# EAGLE design LQFP-64_to_breadboard (EAGLE 8.5.1)
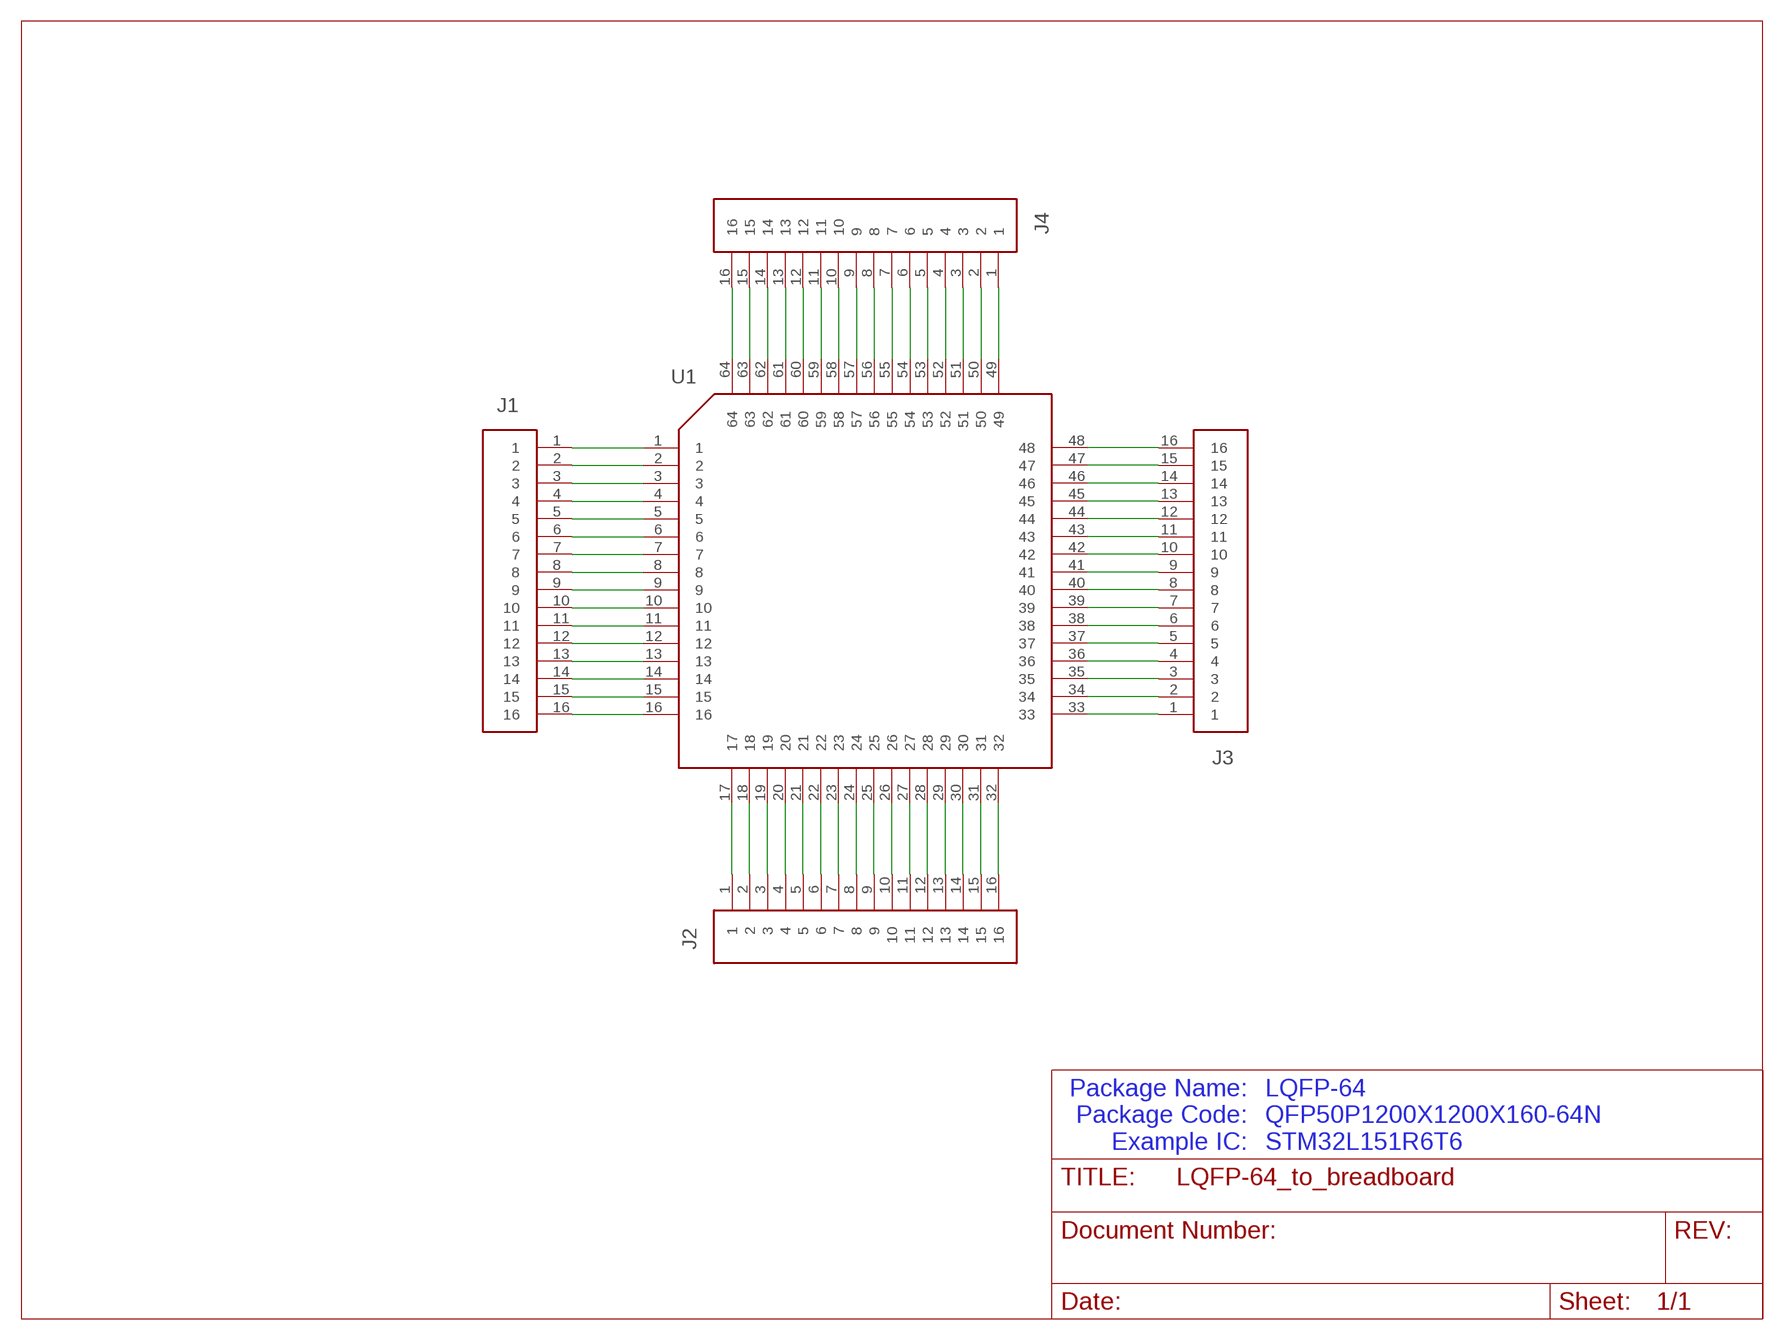
[diagram p0: schematic, sheet 1]

## Parts
J1  CONNECTOR_16  [68000-116HLF]
J2  CONNECTOR_16-NO_SQUARE  [68000-116HLF-NO-SQUARE]
J3  CONNECTOR_16-NO_SQUARE  [68000-116HLF-NO-SQUARE]
J4  CONNECTOR_16-NO_SQUARE  [68000-116HLF-NO-SQUARE]
U1  IC_GENERIC_64-LQFP  [QFP50P1200X1200X160-64N]

## Nets
N$1: J1.1 U1.1
N$2: J1.2 U1.2
N$3: J1.3 U1.3
N$4: J1.4 U1.4
N$5: J1.5 U1.5
N$6: J1.6 U1.6
N$7: J1.7 U1.7
N$8: J1.8 U1.8
N$9: J1.9 U1.9
N$10: J1.10 U1.10
N$11: J1.11 U1.11
N$12: J1.12 U1.12
N$13: J1.13 U1.13
N$14: J1.14 U1.14
N$15: J1.15 U1.15
N$16: J1.16 U1.16
N$17: J2.1 U1.17
N$18: J2.2 U1.18
N$19: J2.3 U1.19
N$20: J2.4 U1.20
N$21: J2.5 U1.21
N$22: J2.6 U1.22
N$23: J2.7 U1.23
N$24: J2.8 U1.24
N$25: J2.9 U1.25
N$26: J2.10 U1.26
N$27: J2.11 U1.27
N$28: J2.12 U1.28
N$29: J2.13 U1.29
N$30: J2.14 U1.30
N$31: J2.15 U1.31
N$32: J2.16 U1.32
N$33: J3.1 U1.33
N$34: J3.2 U1.34
N$35: J3.3 U1.35
N$36: J3.4 U1.36
N$37: J3.5 U1.37
N$38: J3.6 U1.38
N$39: J3.7 U1.39
N$40: J3.8 U1.40
N$41: J3.9 U1.41
N$42: J3.10 U1.42
N$43: J3.11 U1.43
N$44: J3.12 U1.44
N$45: J3.13 U1.45
N$46: J3.14 U1.46
N$47: J3.15 U1.47
N$48: J3.16 U1.48
N$49: J4.1 U1.49
N$50: J4.2 U1.50
N$51: J4.3 U1.51
N$52: J4.4 U1.52
N$53: J4.5 U1.53
N$54: J4.6 U1.54
N$55: J4.7 U1.55
N$56: J4.8 U1.56
N$57: J4.9 U1.57
N$58: J4.10 U1.58
N$59: J4.11 U1.59
N$60: J4.12 U1.60
N$61: J4.13 U1.61
N$62: J4.14 U1.62
N$63: J4.15 U1.63
N$64: J4.16 U1.64

## Notes on the sheet
- Package Name:
  Package Code:
  Example IC:
- LQFP-64
  QFP50P1200X1200X160-64N
  STM32L151R6T6

## Library data of the parts
J1-J4 = SnapEDA:CONNECTOR_16
U1 = SnapEDA:IC_GENERIC_64

## Board
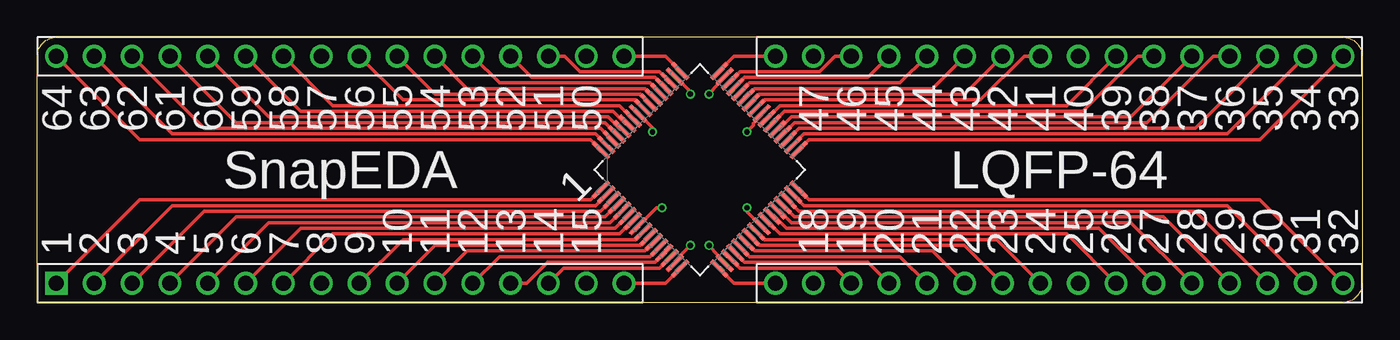
[diagram p1: board, top side]
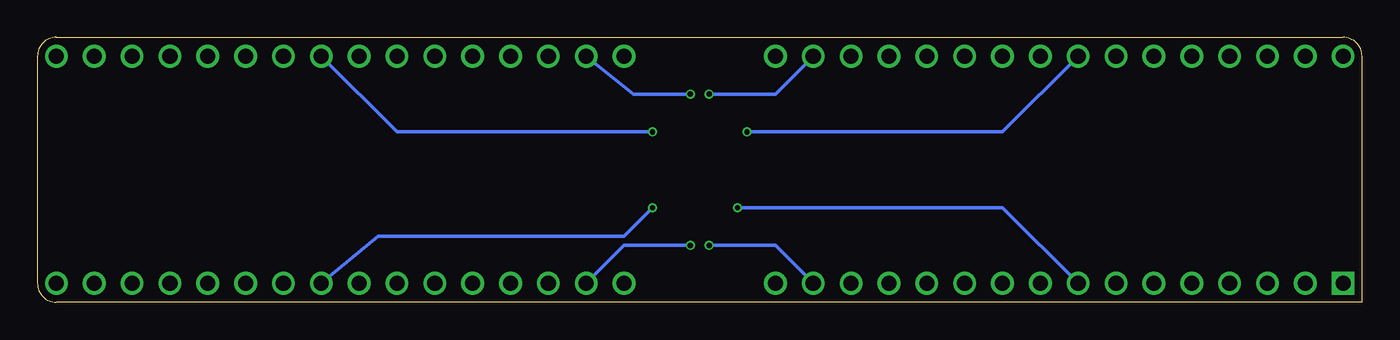
[diagram p2: board, bottom side, seen from below]

Size 88.93 x 17.78 mm. Coordinates in mm from the lower left corner, seen from the top.
Outline: 1.31,17.78 87.65,17.78 arc-90 88.92,16.51 arc0 88.92,1.27 arc-90 87.65,0
Outline: 87.63,0 0.02,0 arc0 0.02,16.51 arc-90 1.29,17.78
Copper layers (1*16): Top 0.035559375mm / dielectric 1.6mm / Bottom 0.035559375mm
Design rules "oshpark-2layer": minimum track width 6mil, minimum drill 10mil, track to track 6mil, track to pad 6mil, pad to pad 6mil, via to via 6mil, smd to smd 6mil, copper to edge 15mil, drill to drill 6mil, minimum pad ring 5mil, minimum via ring 5mil, stop-mask expansion 2.5mil, vias tented up to drill 0mil, thermal gap 10mil

### Footprints (pad centres in the part's own frame; a part is rotated, then mirrored left to right if it is on the bottom)
68000-116HLF = drill 1.016 square: 1 0,0 | drill 1.016: 2 2.54,0; 3 5.08,0; 4 7.62,0; 5 10.16,0; 6 12.7,0; 7 15.24,0; 8 17.78,0; 9 20.32,0; 10 22.86,0; 11 25.4,0; 12 27.94,0; 13 30.48,0; 14 33.02,0; 15 35.56,0; 16 38.1,0
68000-116HLF-NO-SQUARE = drill 1.016: 1 0,0; 2 2.54,0; 3 5.08,0; 4 7.62,0; 5 10.16,0; 6 12.7,0; 7 15.24,0; 8 17.78,0; 9 20.32,0; 10 22.86,0; 11 25.4,0; 12 27.94,0; 13 30.48,0; 14 33.02,0; 15 35.56,0; 16 38.1,0
QFP50P1200X1200X160-64N = smd 1.473 x 0.279: 1 -5.613,3.759; 2 -5.613,3.251; 3 -5.613,2.743; 4 -5.613,2.261; 5 -5.613,1.753; 6 -5.613,1.245; 7 -5.613,0.762; 8 -5.613,0.254; 9 -5.613,-0.254; 10 -5.613,-0.762; 11 -5.613,-1.245; 12 -5.613,-1.753; 13 -5.613,-2.261; 14 -5.613,-2.743; 15 -5.613,-3.251; 16 -5.613,-3.759; 33 5.613,-3.759; 34 5.613,-3.251; 35 5.613,-2.743; 36 5.613,-2.261; 37 5.613,-1.753; 38 5.613,-1.245; 39 5.613,-0.762; 40 5.613,-0.254; 41 5.613,0.254; 42 5.613,0.762; 43 5.613,1.245; 44 5.613,1.753; 45 5.613,2.261; 46 5.613,2.743; 47 5.613,3.251; 48 5.613,3.759 | smd 0.279 x 1.473: 17 -3.759,-5.613; 18 -3.251,-5.613; 19 -2.743,-5.613; 20 -2.261,-5.613; 21 -1.753,-5.613; 22 -1.245,-5.613; 23 -0.762,-5.613; 24 -0.254,-5.613; 25 0.254,-5.613; 26 0.762,-5.613; 27 1.245,-5.613; 28 1.753,-5.613; 29 2.261,-5.613; 30 2.743,-5.613; 31 3.251,-5.613; 32 3.759,-5.613; 49 3.759,5.613; 50 3.251,5.613; 51 2.743,5.613; 52 2.261,5.613; 53 1.753,5.613; 54 1.245,5.613; 55 0.762,5.613; 56 0.254,5.613; 57 -0.254,5.613; 58 -0.762,5.613; 59 -1.245,5.613; 60 -1.753,5.613; 61 -2.261,5.613; 62 -2.743,5.613; 63 -3.251,5.613; 64 -3.759,5.613

### Placement (x,y rotation side)
J1  1.29,1.27 0 top
J2  49.55,1.27 0 top
J3  87.65,16.51 180 top
J4  39.39,16.51 180 top
U1  44.47,8.89 45 top

### Tracks (layer width: path | path; a pad name or v marks a point on that pad's centre or on a via)
N$1
  Top 0.229: U1.1 37.13,6.87 6.89,6.87 J1.1
N$2
  Top 0.229: U1.2 37.47,6.49 9.05,6.49 J1.2
N$3
  Top 0.229: U1.3 37.8,6.11 11.2,6.11 J1.3
N$4
  Top 0.229: U1.4 38.11,5.73 13.36,5.73 J1.4
N$5
  Top 0.229: U1.5 38.44,5.35 15.52,5.35 J1.5
N$6
  Top 0.229: U1.6 38.78,4.97 17.68,4.97 J1.6
N$7
  Top 0.229: U1.7 39.08,4.58 19.84,4.58 J1.7
N$8  (via drill 0.35)
  Top 0.229: U1.8 41.57,6.35 v41.93,6.35
  Bottom 0.229: v41.93,6.35 24.15,6.35 J1.8
N$9
  Top 0.229: U1.9 40.14,4.2 24.54,4.2 J1.9
N$10
  Top 0.229: U1.10 40.48,3.82 26.7,3.82 J1.10
N$11
  Top 0.229: U1.11 40.78,3.44 28.86,3.44 J1.11
N$12
  Top 0.229: J1.12 31.02,3.06 41.11,3.06 U1.12
N$13
  Top 0.229: J1.13 32.85,1.27 34.26,2.68 41.45,2.68 U1.13
N$14
  Top 0.229: J1.14 35.33,2.3 41.75,2.3 U1.14
N$15  (via drill 0.35)
  Top 0.229: U1.15 42.8,2.77 43.32,3.29 43.32,3.3 v43.83,3.81
  Bottom 0.229: v43.83,3.81 39.39,3.81 J1.15
N$16
  Top 0.229: U1.16 42.16,1.27 J1.16
N$17
  Top 0.229: U1.17 46.77,1.27 J2.1
N$18  (via drill 0.35)
  Top 0.229: U1.18 v45.1,3.81
  Bottom 0.229: v45.1,3.81 49.55,3.81 J2.2
N$19
  Top 0.229: U1.19 47.18,2.3 53.6,2.3 J2.3
N$20
  Top 0.229: U1.20 47.48,2.68 55.76,2.68 J2.4
N$21
  Top 0.229: J2.5 57.91,3.06 47.82,3.06 U1.21
N$22
  Top 0.229: U1.22 48.15,3.44 60.07,3.44 J2.6
N$23
  Top 0.229: J2.7 62.23,3.82 48.46,3.82 U1.23
N$24
  Top 0.229: U1.24 48.79,4.2 64.39,4.2 J2.8
N$25  (via drill 0.35)
  Top 0.229: U1.25 47.64,6.07 v47.64,6.35
  Bottom 0.229: v47.64,6.35 49.55,4.45 66.06,4.45 J2.9
N$26
  Top 0.229: U1.26 49.85,4.58 69.09,4.58 J2.10
N$27
  Top 0.229: U1.27 49.46,5.8 50.29,4.97 71.25,4.97 J2.11
N$28
  Top 0.229: U1.28 49.82,6.16 50.63,5.35 73.41,5.35 J2.12
N$29
  Top 0.229: U1.29 50.82,5.73 75.57,5.73 J2.13
N$30
  Top 0.229: U1.30 51.13,6.11 77.73,6.11 J2.14
N$31
  Top 0.229: U1.31 51.46,6.49 79.89,6.49 J2.15
N$32
  Top 0.229: U1.32 51.8,6.87 82.04,6.87 J2.16
N$33
  Top 0.229: U1.33 51.8,10.91 82.04,10.91 J3.1
N$34
  Top 0.229: J3.2 79.89,11.29 51.46,11.29 U1.34
N$35
  Top 0.229: U1.35 51.13,11.67 77.73,11.67 J3.3
N$36
  Top 0.229: J3.4 78.94,16.51 74.48,12.05 50.82,12.05 U1.36
N$37
  Top 0.229: U1.37 49.82,11.62 50.63,12.43 73.41,12.43 J3.5
N$38
  Top 0.229: U1.38 50.15,12.81 70.16,12.81 73.86,16.51 J3.6
N$39
  Top 0.229: U1.39 49.85,13.2 69.09,13.2 J3.7
N$40  (via drill 0.35)
  Top 0.229: U1.40 48.61,12.54 48.09,12.01 48.09,11.88 v47.64,11.43
  Bottom 0.229: J3.8 64.79,11.43 v47.64,11.43
N$41
  Top 0.229: J3.9 66.24,16.51 63.31,13.58 48.79,13.58 U1.41
N$42
  Top 0.229: U1.42 48.46,13.96 62.23,13.96 J3.10
N$43
  Top 0.229: U1.43 48.15,14.34 60.07,14.34 J3.11
N$44
  Top 0.229: J3.12 57.91,14.72 47.82,14.72 U1.44
N$45
  Top 0.229: U1.45 47.48,15.1 55.76,15.1 J3.13
N$46
  Top 0.229: J3.14 53.54,16.51 52.51,15.48 47.18,15.48 U1.46
N$47  (via drill 0.35)
  Top 0.229: U1.47 v45.1,13.97
  Bottom 0.229: v45.1,13.97 48.91,13.97 J3.15
N$48
  Top 0.229: U1.48 46.77,16.51 J3.16
N$49
  Top 0.229: U1.49 42.16,16.51 J4.1
N$50  (via drill 0.35)
  Top 0.229: U1.50 43.83,14.12 v43.83,13.97
  Bottom 0.229: v43.83,13.97 39.39,13.97 J4.2
N$51
  Top 0.229: J4.3 35.39,16.51 36.42,15.48 41.75,15.48 U1.51
N$52
  Top 0.229: U1.52 41.45,15.1 33.18,15.1 J4.4
N$53
  Top 0.229: U1.53 41.11,14.72 31.02,14.72 J4.5
N$54
  Top 0.229: U1.54 40.78,14.34 28.86,14.34 J4.6
N$55
  Top 0.229: U1.55 40.48,13.96 26.7,13.96 J4.7
N$56
  Top 0.229: J4.8 24.54,13.58 40.14,13.58 U1.56
N$57  (via drill 0.35)
  Top 0.229: U1.57 41.29,11.71 v41.29,11.43
  Bottom 0.229: v41.29,11.43 24.15,11.43 J4.9
N$58
  Top 0.229: U1.58 39.08,13.2 19.84,13.2 J4.10
N$59
  Top 0.229: U1.59 39.47,11.98 38.64,12.81 17.68,12.81 J4.11
N$60
  Top 0.229: U1.60 39.11,11.62 38.3,12.43 15.52,12.43 J4.12
N$61
  Top 0.229: U1.61 38.11,12.05 13.36,12.05 J4.13
N$62
  Top 0.229: U1.62 37.8,11.67 11.2,11.67 J4.14
N$63
  Top 0.229: U1.63 37.47,11.29 9.05,11.29 J4.15
N$64
  Top 0.229: U1.64 37.13,10.91 6.89,10.91 J4.16

### Text on the board
tPlace: 64 | 63 | 62 | 61 | 60 | 59 | 58 | 57 | 56 | 55 | 54 | 53 | 52 | 51 | 50 | 47 | 46 | 45 | 44 | 43 | 42 | 41 | 40 | 39 | 38 | 37 | 36 | 35 | 34 | 33 | SnapEDA | LQFP-64 | 1 | 1 | 2 | 3 | 4 | 5 | 6 | 7 | 8 | 9 | 10 | 11 | 12 | 13 | 14 | 15 | 18 | 19 | 20 | 21 | 22 | 23 | 24 | 25 | 26 | 27 | 28 | 29 | 30 | 31 | 32